# EAGLE design power-switch (EAGLE 9.5.1)
CNAME: PepeTech; CREVISION: 2.0; DESIGNER: Joao Silva

## Sheet 1 of 4: Power
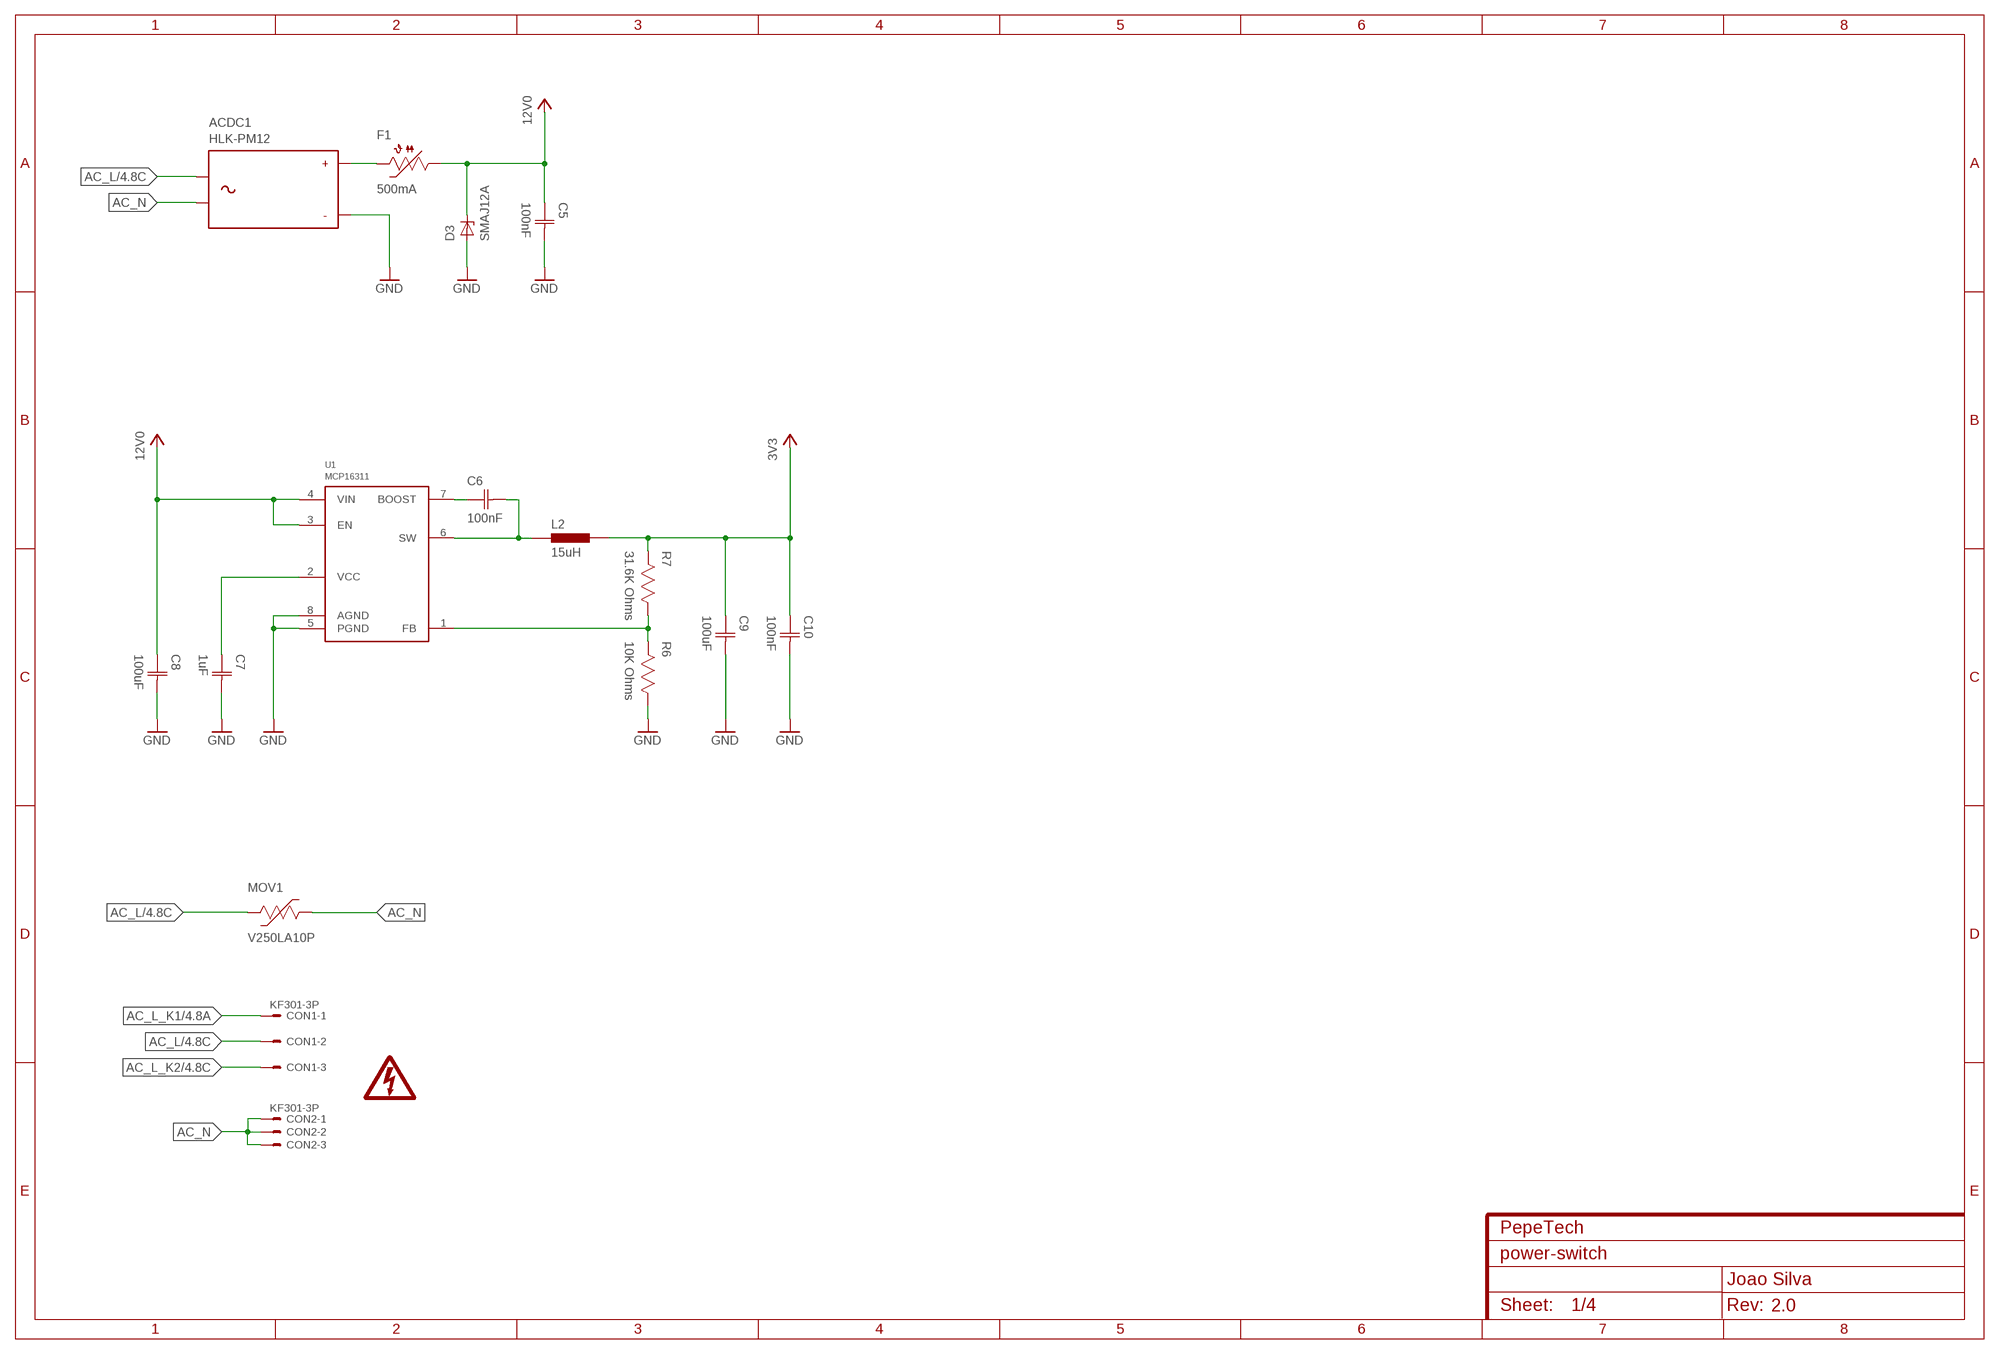
[diagram p0: schematic, sheet 1]

### Parts
ACDC1  HLK-PM12  [HLK-PM12]
C5  100nF  CAPACITOR-0603  [CAP0603]
C6  100nF  CAPACITOR-0603  [CAP0603]
C7  1uF  CAPACITOR-0603  [CAP0603]
C8  100uF  CAPACITOR-1206  [CAP1206]
C9  100uF  CAPACITOR-1206  [CAP1206]
C10  100nF  CAPACITOR-0603  [CAP0603]
CON1  KF301-3P  [KF301-3P]
CON2  KF301-3P  [KF301-3P]
D3  SMAJ12A  [DO214AC]
F1  500mA Hold  PTC1812  [1812]
L2  15uH  INDUCTOR-2.5X2X1.2MM  [IND2520]
LOGO1  HV_WARNING  [HV_WARNING]
MOV1  V250LA10P  [VXXXLA10P]
R6  10K Ohms  RESISTOR-0603  [RES0603]
R7  31.6K Ohms  RESISTOR-0603  [RES0603]
U1  MCP16311  [MSOP8]

### Nets
3V3: C9.1(C1) C10.1(C1) L2.2 R7.2 ; also sheet 2,3,4
12V0: C5.1(C1) C8.1(C1) D3.C F1.1 U1.3(EN) U1.4(VIN) ; also sheet 4
AC_L: ACDC1.AC1 CON1.2 MOV1.2 ; also sheet 4
AC_L_K1: CON1.1 ; also sheet 4
AC_L_K2: CON1.3 ; also sheet 4
AC_N: ACDC1.AC2 CON2.1 CON2.2 CON2.3 MOV1.1
GND: ACDC1.-VO C5.2(C2) C7.2(C2) C8.2(C2) C9.2(C2) C10.2(C2) D3.A R6.1 U1.5(PGND) U1.8(AGND) ; also sheet 2,3,4
N$6: C6.2(C2) L2.1 U1.6(SW)
N$7: ACDC1.+VO F1.2
N$8: C6.1(C1) U1.7(BOOST)
N$9: C7.1(C1) U1.2(VCC)
N$10: R6.2 R7.1 U1.1(FB)

## Sheet 2 of 4: Main MCU
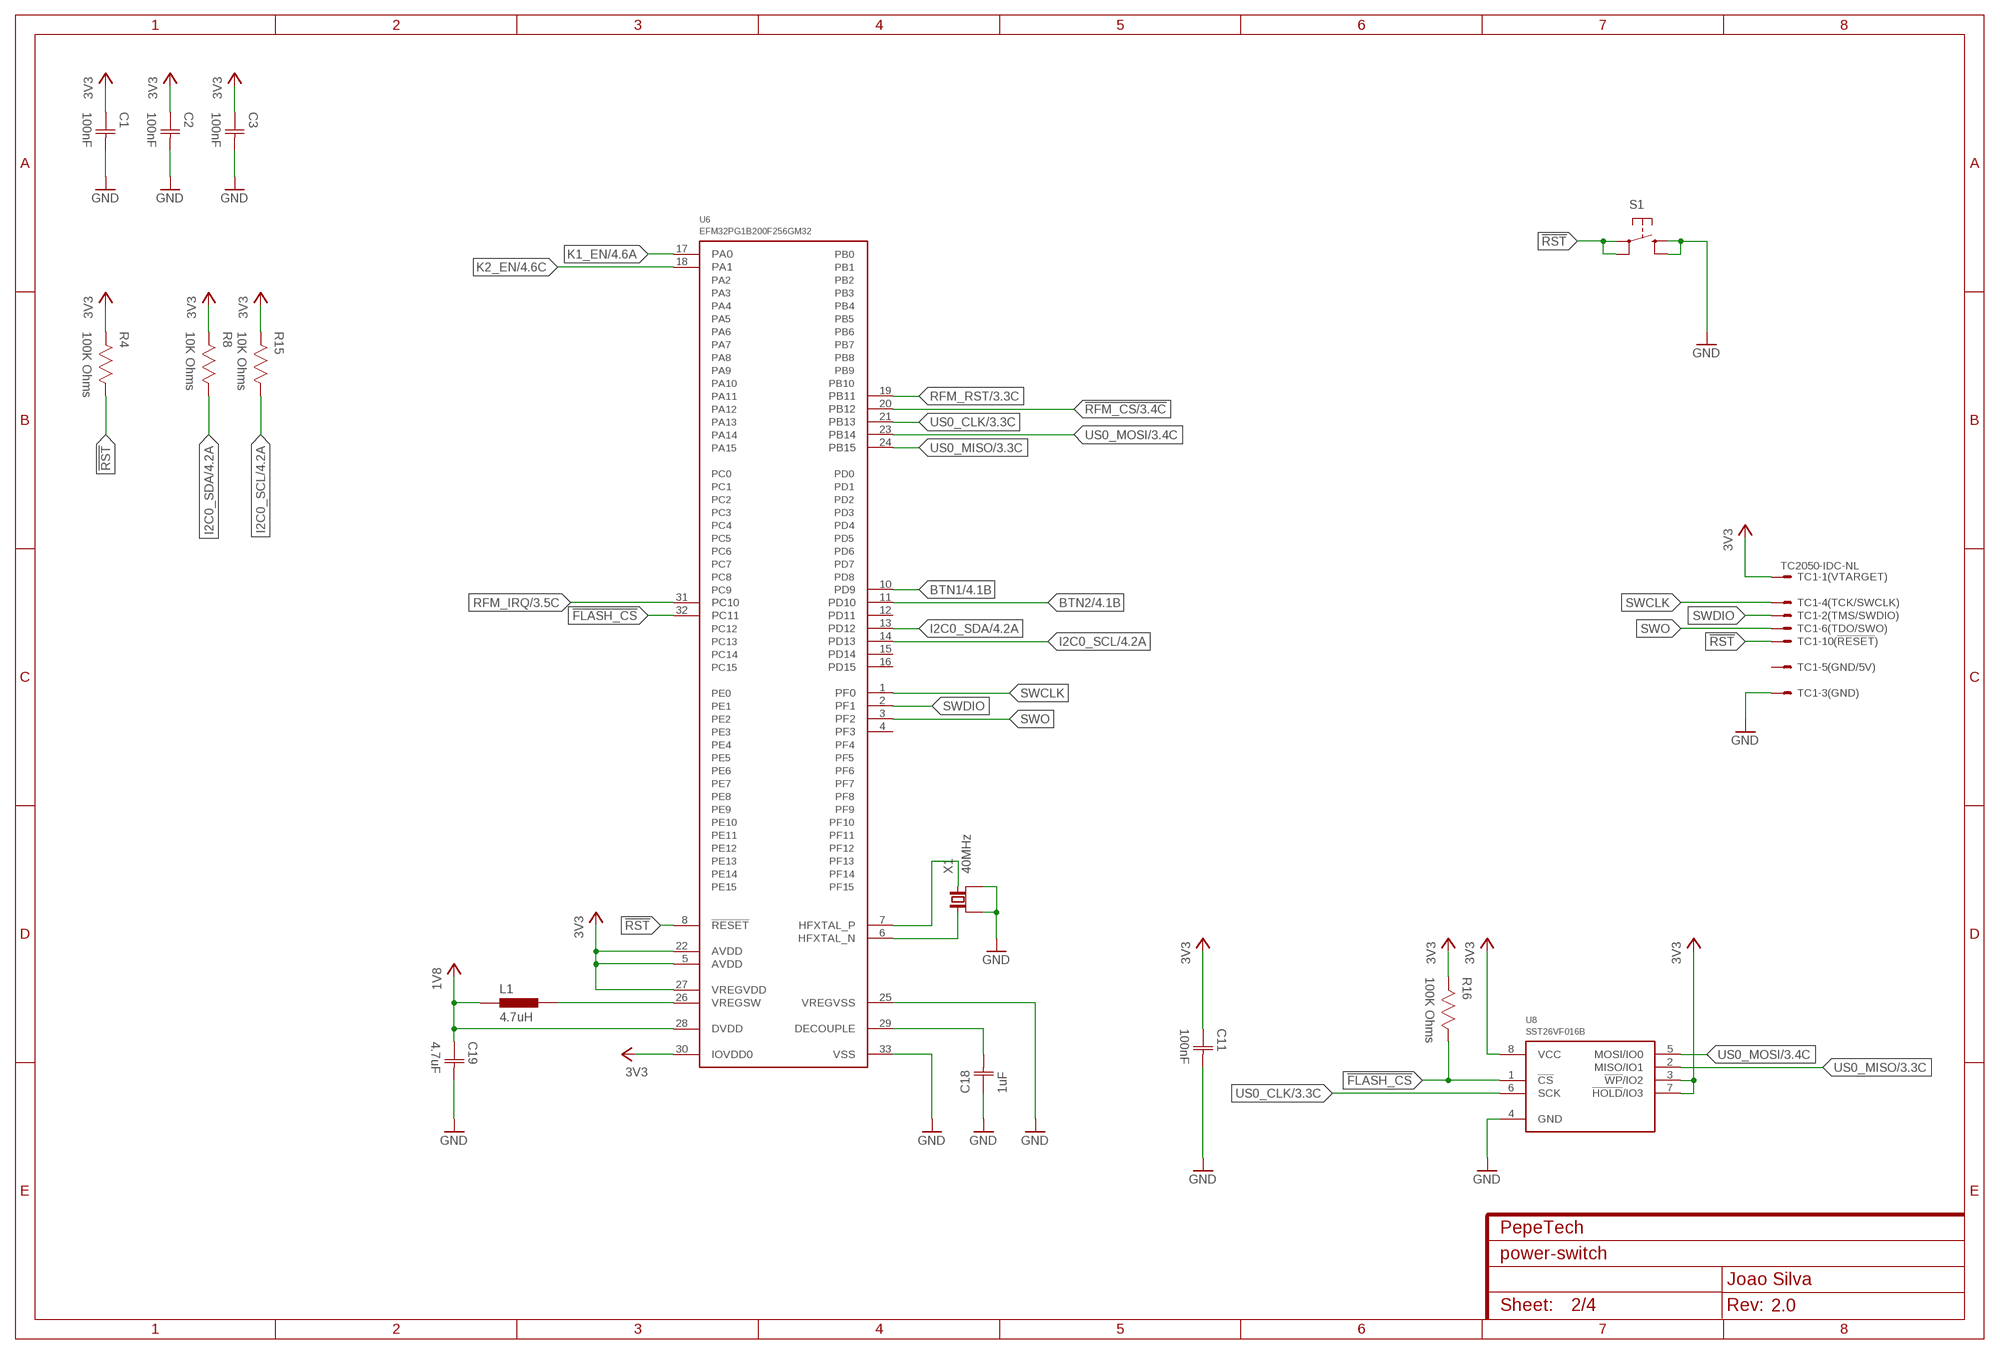
[diagram p1: schematic, sheet 2]

### Parts
C1  100nF  CAPACITOR-0603  [CAP0603]
C2  100nF  CAPACITOR-0603  [CAP0603]
C3  100nF  CAPACITOR-0603  [CAP0603]
C11  100nF  CAPACITOR-0603  [CAP0603]
C18  1uF  CAPACITOR-0603  [CAP0603]
C19  4.7uF  CAPACITOR-0603  [CAP0603]
L1  4.7uH  INDUCTOR-0603  [IND0603]
R4  100K Ohms  RESISTOR-0603  [RES0603]
R8  10K Ohms  RESISTOR-0603  [RES0603]
R15  10K Ohms  RESISTOR-0603  [RES0603]
R16  100K Ohms  RESISTOR-0603  [RES0603]
S1  TAC_SWITCHSMD  [TAC_SW_SMD_RESET]
TC1  TC2050-IDC-NL  [TC2050-IDC-NL]
U6  EFM32PG1B200F256GM32  [QFN32_0.5P]
U8  SST26VF016B  [WSOIC8]
X1  40MHz  CRYSTAL_4P  [4-SMD-3225]

### Nets
1V8: C19.1(C1) L1.1 U6.28(DVDD)
3V3: C1.1(C1) C2.1(C1) C3.1(C1) C11.1(C1) R4.2 R8.2 R15.2 R16.2 TC1.1 U6.5(AVDD) U6.22(AVDD) U6.27(VREGVDD) U6.30(IOVDD0) U8.3(!WP!/IO2) U8.7(!HOLD!/IO3) U8.8(VCC) ; also sheet 1,3,4
!FLASH_CS: R16.1 U6.32(PC11) U8.1(!CS!)
!RFM_CS: U6.20(PB12) ; also sheet 3
!RST: R4.1 S1.1 S1.2 TC1.10 U6.8(!RESET)
BTN1: U6.10(PD9) ; also sheet 4
BTN2: U6.11(PD10) ; also sheet 4
GND: C1.2(C2) C2.2(C2) C3.2(C2) C11.2(C2) C18.1(C1) C19.2(C2) S1.3 S1.4 TC1.3 U6.25(VREGVSS) U6.33(VSS) U8.4(GND) X1.1(GND) X1.3(GND) ; also sheet 1,3,4
I2C0_SCL: R15.1 U6.14(PD13) ; also sheet 4
I2C0_SDA: R8.1 U6.13(PD12) ; also sheet 4
K1_EN: U6.17(PA0) ; also sheet 4
K2_EN: U6.18(PA1) ; also sheet 4
N$16: U6.6(HFXTAL_N) X1.2
N$17: U6.7(HFXTAL_P) X1.4
N$19: L1.2 U6.26(VREGSW)
N$20: C18.2(C2) U6.29(DECOUPLE)
RFM_IRQ: U6.31(PC10) ; also sheet 3
RFM_RST: U6.19(PB11) ; also sheet 3
SWCLK: TC1.4 U6.1(PF0)
SWDIO: TC1.2 U6.2(PF1)
SWO: TC1.6 U6.3(PF2)
US0_CLK: U6.21(PB13) U8.6(SCK) ; also sheet 3
US0_MISO: U6.24(PB15) U8.2(MISO/IO1) ; also sheet 3
US0_MOSI: U6.23(PB14) U8.5(MOSI/IO0) ; also sheet 3
Unconnected: TC1.5 TC1.7 TC1.8 TC1.9 U6.4(PF3) U6.12(PD11) U6.15(PD14) U6.16(PD15)

## Sheet 3 of 4: ISM Radio
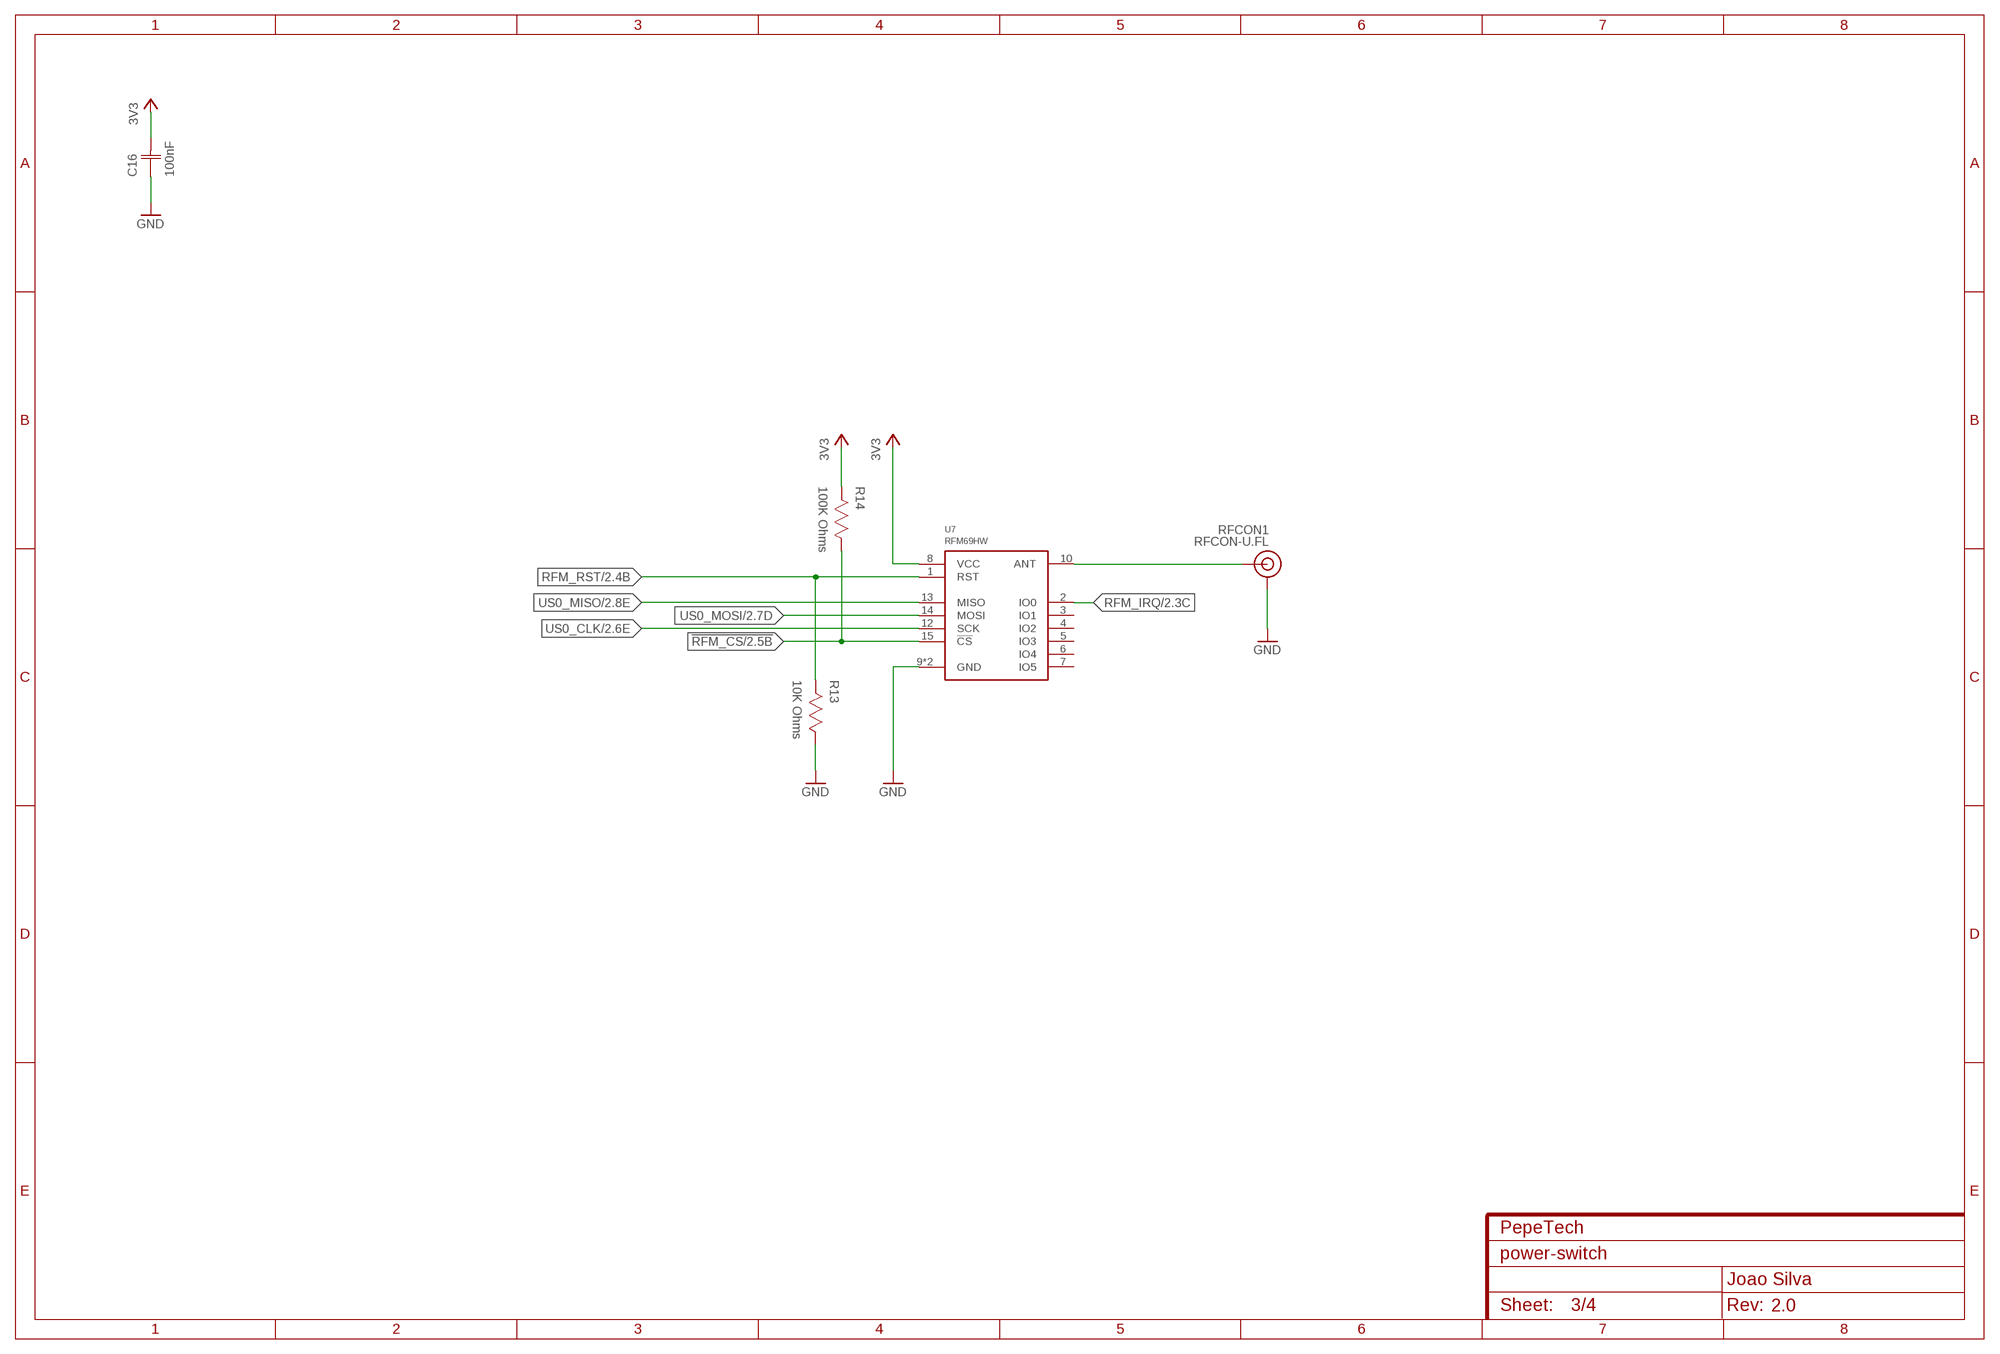
[diagram p2: schematic, sheet 3]

### Parts
C16  100nF  CAPACITOR-0603  [CAP0603]
R13  10K Ohms  RESISTOR-0603  [RES0603]
R14  100K Ohms  RESISTOR-0603  [RES0603]
RFCON1  RFCON-U.FL  [U.FL]
U7  RFM69HW  [RFM69XW-XXXS2]

### Nets
3V3: C16.2(C2) R14.2 U7.8(VCC) ; also sheet 1,2,4
!RFM_CS: R14.1 U7.15(!CS) ; also sheet 2
GND: C16.1(C1) R13.1 RFCON1.P$1(GND) RFCON1.P$2(GND) U7.9(GND) U7.11(GND) ; also sheet 1,2,4
N$1: RFCON1.P$3(SIGNAL) U7.10(ANT)
RFM_IRQ: U7.2(IO0) ; also sheet 2
RFM_RST: R13.2 U7.1(RST) ; also sheet 2
US0_CLK: U7.12(SCK) ; also sheet 2
US0_MISO: U7.13(MISO) ; also sheet 2
US0_MOSI: U7.14(MOSI) ; also sheet 2
Unconnected: U7.3(IO1) U7.4(IO2) U7.5(IO3) U7.6(IO4) U7.7(IO5)

## Sheet 4 of 4: Sensors/Interface
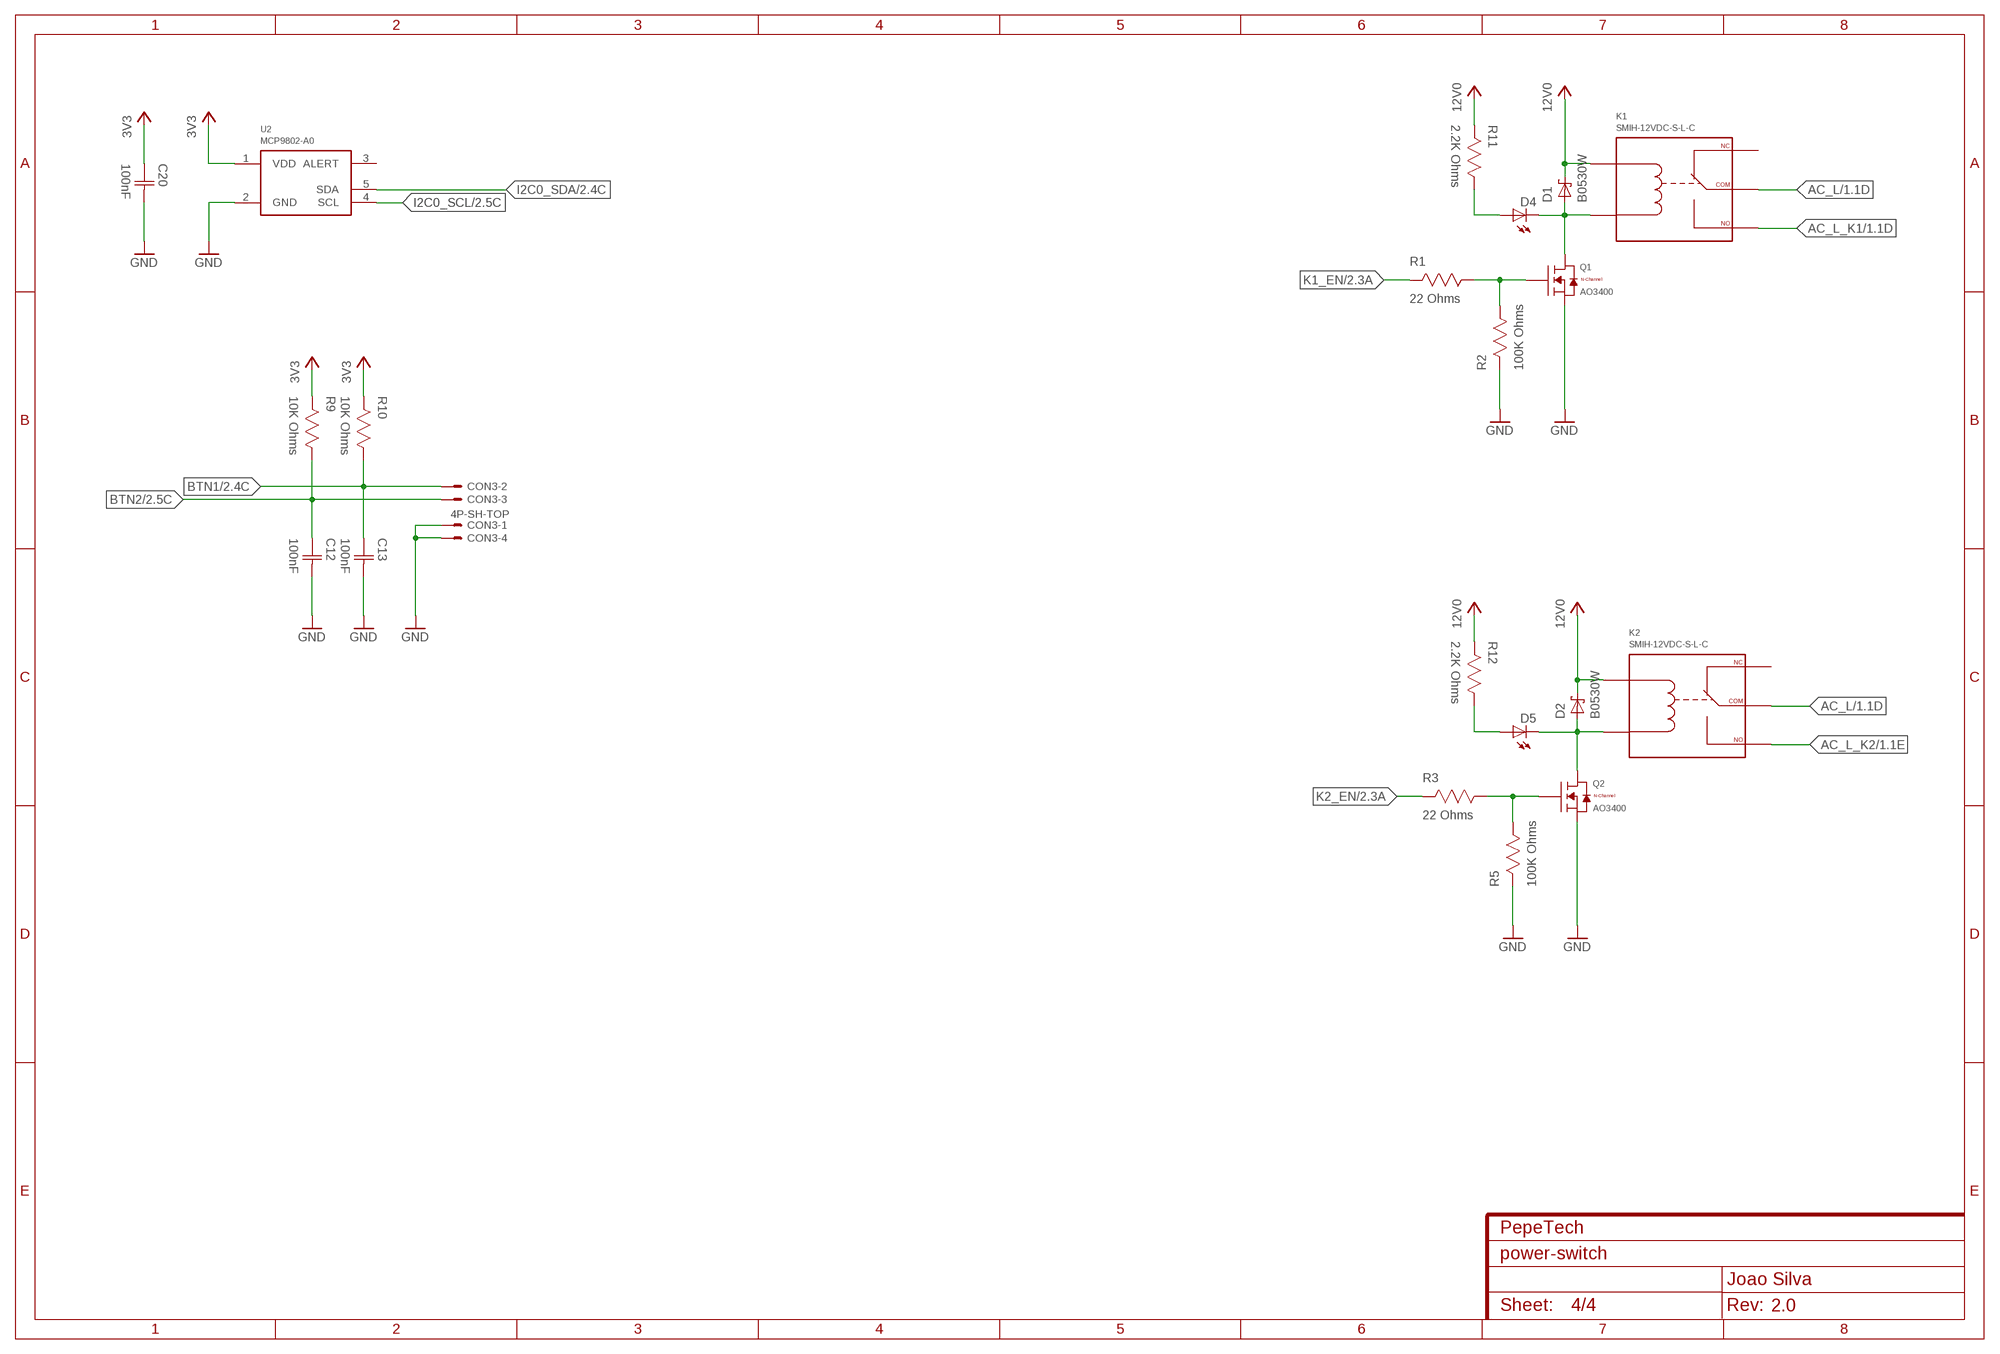
[diagram p3: schematic, sheet 4]

### Parts
C12  100nF  CAPACITOR-0603  [CAP0603]
C13  100nF  CAPACITOR-0603  [CAP0603]
C20  100nF  CAPACITOR-0603  [CAP0603]
CON3  4P-SH-TOP  [SH-04-TOP]
D1  B0530W  [SOD-123]
D2  B0530W  [SOD-123]
D4  LED1206  [1206]
D5  LED1206  [1206]
K1  SMIH-12VDC-S-L-C  [SMIH-12VDC-S-L-C]
K2  SMIH-12VDC-S-L-C  [SMIH-12VDC-S-L-C]
Q1  AO3400  [SOT23]
Q2  AO3400  [SOT23]
R1  22 Ohms  RESISTOR-0603  [RES0603]
R2  100K Ohms  RESISTOR-0603  [RES0603]
R3  22 Ohms  RESISTOR-0603  [RES0603]
R5  100K Ohms  RESISTOR-0603  [RES0603]
R9  10K Ohms  RESISTOR-0603  [RES0603]
R10  10K Ohms  RESISTOR-0603  [RES0603]
R11  2.2K Ohms  RESISTOR-0603  [RES0603]
R12  2.2K Ohms  RESISTOR-0603  [RES0603]
U2  MCP9802-A0  [SOT23-5]

### Nets
3V3: C20.1(C1) R9.2 R10.2 U2.1(VDD) ; also sheet 1,2,3
12V0: D1.C D2.C K1.COIL1 K2.COIL1 R11.2 R12.2 ; also sheet 1
AC_L: K1.COM1(COM) K1.COM2(COM) K2.COM1(COM) K2.COM2(COM) ; also sheet 1
AC_L_K1: K1.NO1(NO) K1.NO2(NO) ; also sheet 1
AC_L_K2: K2.NO1(NO) K2.NO2(NO) ; also sheet 1
BTN1: C13.1(C1) CON3.2 R10.1 ; also sheet 2
BTN2: C12.1(C1) CON3.3 R9.1 ; also sheet 2
GND: C12.2(C2) C13.2(C2) C20.2(C2) CON3.1 CON3.4 Q1.2(S) Q2.2(S) R2.2 R5.2 U2.2(GND) ; also sheet 1,2,3
I2C0_SCL: U2.4(SCL) ; also sheet 2
I2C0_SDA: U2.5(SDA) ; also sheet 2
K1_EN: R1.2 ; also sheet 2
K2_EN: R3.2 ; also sheet 2
N$2: Q1.1(G) R1.1 R2.1
N$3: D1.A D4.C K1.COIL2 Q1.3(D)
N$4: Q2.1(G) R3.1 R5.1
N$5: D2.A D5.C K2.COIL2 Q2.3(D)
N$11: D4.A R11.1
N$12: D5.A R12.1
Unconnected: K1.NC1(NC) K1.NC2(NC) K2.NC1(NC) K2.NC2(NC) U2.3(ALERT)

## Library data of the parts
ACDC1 = ACDC Converter:HLK-PM
C1-C3 C5-C13 C16 C18-C20 = Capacitor:CAPACITOR
CON1 CON2 = Generic Connector:KF301-3P
CON3 = JST:4P: Disconnectable Crimp style connector, 1.0mm pitch 4 contacts
D1 D2 = Generic Diode:B0530W
D3 = TVS:SMAJ*A: SMAJ Series TVS Diodes Source: http://www.littelfuse.com/~/media/electronics/datasheets/tvs_diodes/littelfuse_tvs_diode_smaj_datasheet.pdf.pdf; MF: Littelfuse; MPN: SMAJ12A; OC_FARNELL: 1827602; OC_NEWARK: 71J1937
D4 D5 = LED:LED
F1 = PTC Fuses:PTC; HOLD: 500mA
K1 K2 = Relay:SMIH-12VDC-S-L-C
L1 = Inductor:INDUCTOR; OCLCSC: C281111
L2 = Inductor:INDUCTOR; OCLCSC: C365885
LOGO1 = Silkscreen:HV_WARNING
MOV1 = Varistor:V250LA10P
Q1 Q2 = Alpha Omega:AO3400
R1-R16 = Resistor:RESISTOR
RFCON1 = RF Connector:RFCON
S1 = Switch:TAC_SWITCH: Momentary Switch Button commonly used for reset or general input. Spark Fun Electronics SKU : COM-00097
TC1 = TagConnect:TC2050-IDC
U1 = Microchip:MCP1631*
U2 = Microchip:MCP9802-A*
U6 = EFM32:EFM32PG1B200F*M32
U7 = HopeRF:RFM69*
U8 = Microchip:SST26VF016B
X1 = Crystal:CRYSTAL_4P

## Board
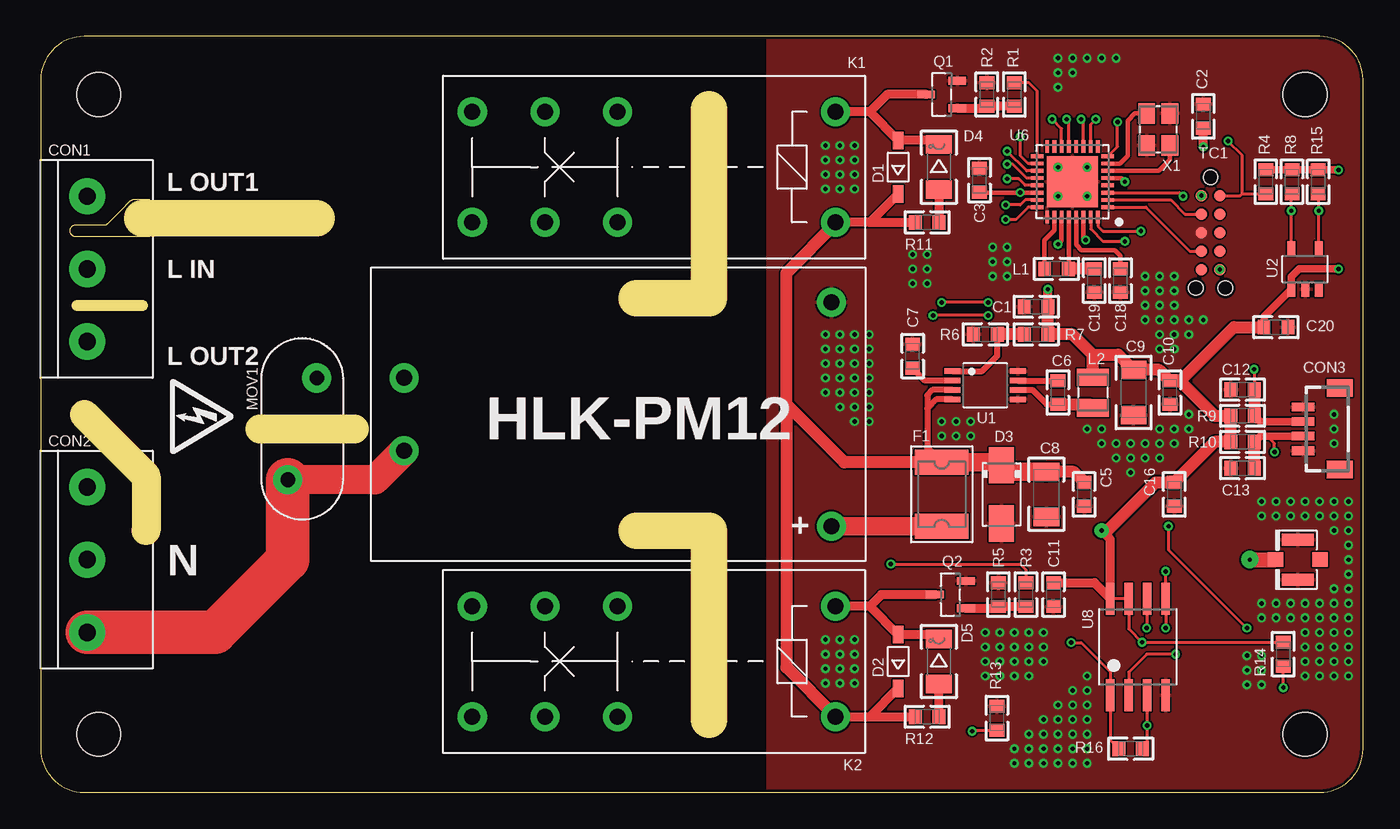
[diagram p4: board, top side]
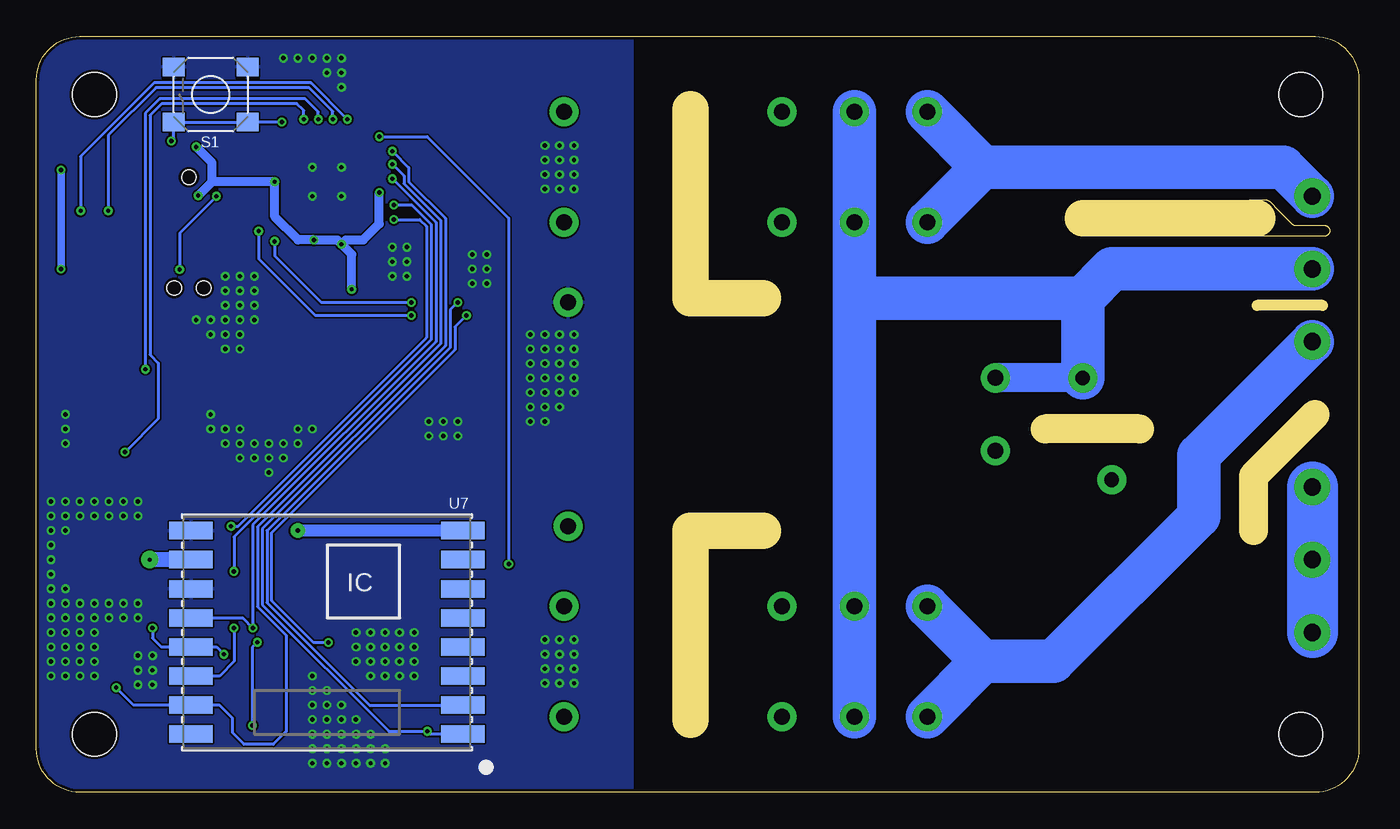
[diagram p5: board, bottom side, seen from below]

Size 91 x 52 mm. Coordinates in mm from the lower left corner, seen from the top.
Outline: 0,49 0,3 arc90 3,0 88,0 arc90 91,3 91,49 arc90 88,52 3,52 arc90 0,49
Copper layers (1*16): Top 0.035mm / dielectric 1.6mm / Bottom 0.035mm
Design rules "jlcpcb_2layer": minimum track width 5mil, minimum drill 0.3mm, track to track 5mil, track to pad 5mil, pad to pad 5mil, via to via 5mil, smd to smd 5mil, copper to edge 0.2mm, drill to drill 5mil, minimum pad ring 3mil, minimum via ring 3mil, stop-mask expansion 0.075mm, vias tented up to drill 10mm, thermal gap 5mil
Holes 3 mm at 4,48 87,48 87,4 4,4
Milling: area 2,38.2 to 7.5,40.8; 9 lines

### Footprints (pad centres in the part's own frame; a part is rotated, then mirrored left to right if it is on the bottom)
HLK-PM12 = drill 1.1 pad 2: +VO 29.4,-7.7; -VO 29.4,7.7; AC1 0,2.5; AC2 0,-2.5
CAP0603 = smd 0.889 x 1.016: 1 -0.819,0; 2 0.819,0
CAP1206 = smd 1.27 x 1.778: 1 -1.549,0; 2 1.549,0
KF301-3P = drill 1.2 pad 2.5: 1 -5,0; 2 0,0; 3 5,0
SH-04-TOP = smd 0.6 x 1.55: 1 1.5,-1.625; 2 0.5,-1.625; 3 -0.5,-1.625; 4 -1.5,-1.625 | smd 1.2 x 1.8: FIT@1 2.8,0.9; FIT@2 -2.8,0.9
SOD-123 = smd 1.2 x 0.7: A 1.85,0; C -1.85,0
DO214AC = smd 2.5 x 1.7: A 2,0; C -2,0
1206 = smd 1.27 x 1.778: A 1.549,0; C -1.549,0
1812 = smd 1.7 x 3.7: 1 -2.2,0; 2 2.2,0
SMIH-12VDC-S-L-C = drill 1.1 pad 2: COIL1 -15,3.8; COIL2 -15,-3.8; COM1 5,3.8; COM2 5,-3.8; NC1 0,3.8; NC2 0,-3.8; NO1 10,3.8; NO2 10,-3.8
IND0603 = smd 0.889 x 1.016: 1 -0.819,0; 2 0.819,0
IND2520 = smd 2.2 x 1.2: 1 0,-1.05; 2 0,1.05
VXXXLA10P = drill 1 pad 2: 1 -3.5,1; 2 3.5,-1
SOT23 = smd 1.219 x 0.533: 1 -1.067,0.94; 2 -1.067,-0.94; 3 1.067,0
RES0603 = smd 0.889 x 1.016: 1 -0.819,0; 2 0.819,0
U.FL = smd 2.2 x 0.85: P$1 0,1.375; P$2 0,-1.375 | smd 1.05 x 1: P$3 1.525,0; P$4 -1.525,0
TAC_SW_SMD_RESET = smd 1.524 x 1.27: 1 -2.54,1.905; 2 2.54,1.905; 3 -2.54,-1.905; 4 2.54,-1.905
TC2050-IDC-NL = smd 0.787 x 0.787: 1 -2.54,-0.635; 2 -1.27,-0.635; 3 0,-0.635; 4 1.27,-0.635; 5 2.54,-0.635; 6 2.54,0.635; 7 1.27,0.635; 8 0,0.635; 9 -1.27,0.635; 10 -2.54,0.635 | hole 0.991: -3.81,0; 3.81,1.016; 3.81,-1.016
MSOP8 = smd 0.4 x 1.1: 1 -0.975,-2.25; 2 -0.325,-2.25; 3 0.325,-2.25; 4 0.975,-2.25; 5 0.975,2.25; 6 0.325,2.25; 7 -0.325,2.25; 8 -0.975,2.25
SOT23-5 = smd 1 x 0.55: 1 -1.4,0.95; 2 -1.4,0; 3 -1.4,-0.95; 4 1.4,-0.95; 5 1.4,0.95
QFN32_0.5P = smd 0.86 x 0.26: 1 -2.43,1.75; 2 -2.43,1.25; 3 -2.43,0.75; 4 -2.43,0.25; 5 -2.43,-0.25; 6 -2.43,-0.75; 7 -2.43,-1.25; 8 -2.43,-1.75; 17 2.43,-1.75; 18 2.43,-1.25; 19 2.43,-0.75; 20 2.43,-0.25; 21 2.43,0.25; 22 2.43,0.75; 23 2.43,1.25; 24 2.43,1.75 | smd 0.26 x 0.86: 9 -1.75,-2.43; 10 -1.25,-2.43; 11 -0.75,-2.43; 12 -0.25,-2.43; 13 0.25,-2.43; 14 0.75,-2.43; 15 1.25,-2.43; 16 1.75,-2.43; 25 1.75,2.43; 26 1.25,2.43; 27 0.75,2.43; 28 0.25,2.43; 29 -0.25,2.43; 30 -0.75,2.43; 31 -1.25,2.43; 32 -1.75,2.43 | smd 3.5 x 3.5: 33 0,0
RFM69XW-XXXS2 = smd 3 x 1.2: 1 -9.35,7; 2 -9.35,5; 3 -9.35,3; 4 -9.35,1; 5 -9.35,-1; 6 -9.35,-3; 7 -9.35,-5; 8 -9.35,-7; 9 9.35,-7; 10 9.35,-5; 11 9.35,-3; 12 9.35,-1; 13 9.35,1; 14 9.35,3; 15 9.35,5; 16 9.35,7
WSOIC8 = smd 0.6 x 2.2: 1 -1.905,-3.33; 2 -0.635,-3.33; 3 0.635,-3.33; 4 1.905,-3.33; 5 1.905,3.33; 6 0.635,3.33; 7 -0.635,3.33; 8 -1.905,3.33
4-SMD-3225 = smd 1.4 x 1.15: 1 -1.1,0.8; 2 1.1,0.8; 3 1.1,-0.8; 4 -1.1,-0.8

### Placement (x,y rotation side)
ACDC1  25,26 0 top
C1  68.5,33.4 180 top
C2  80,46.5 90 top
C3  64.6,42.1 90 top
C5  71.8,20.5 270 top
C6  70,27.5 270 top
C7  60,30 90 top
C8  69.2,20.5 270 top
C9  75.2,27.5 270 top
C10  77.7,27.5 270 top
C11  69.7,13.6 270 top
C12  82.7,27.7 180 top
C13  82.7,22.3 180 top
C16  78,20.5 90 top
C18  74.3,35.2 90 top
C19  72.5,35.2 270 top
C20  85,32 0 top
CON1  3.2,36 270 top
CON2  3.2,16 270 top
CON3  88.5,25 270 top
D1  59,43 90 top
D2  59,9 90 top
D3  66.1,20.5 270 top
D4  61.8,43 270 top
D5  61.8,9 270 top
F1  62,20.5 270 top
K1  39.7,43 180 top
K2  39.7,9 180 top
L1  69.9,36 180 top
L2  72.4,27.5 0 top
LOGO1  8.9,28.4 270 top
MOV1  18,25 90 top
Q1  62,48 180 top
Q2  62.6,13.6 180 top
R1  67,48 90 top
R2  65.1,48 90 top
R3  67.8,13.6 90 top
R4  84.3,42 90 top
R5  65.9,13.6 90 top
R6  65,31.5 0 top
R7  68.5,31.5 0 top
R8  86.1,42 90 top
R9  82.7,25.9 180 top
R10  82.7,24.1 180 top
R11  61,39.2 180 top
R12  61,5.2 180 top
R13  65.8,5.1 270 top
R14  85.5,9.5 90 top
R15  87.9,42 90 top
R16  75,3 0 top
RFCON1  86.5,16 180 top
S1  79,48 180 bottom
TC1  80.5,38.5 270 top
U1  65,28 270 top
U2  87,36 90 top
U6  71,42 180 top
U7  71,11 180 bottom
U8  75.5,10 0 top
X1  76.9,45.6 270 top

### Tracks (layer width: path | path; a pad name or v marks a point on that pad's centre or on a via)
1V8
  Top 0.305: U6.28 70.75,36.03 70.74,36.02
  Top 0.813: C19.1 70.74,36.02 L1.1
3V3  (via drill 0.3, 0.3 pad 1)
  Top 0.2: U8.8 U8.7 74.86,11.23 v75.78,10.32 R14.2 | R16.2 76.14,3.32 v76.14,4.6 U8.3
  Top 0.305: U6.22 v67.4,41.25 64.63,41.25 C3.1 | v70,37.7 70.25,37.95 U6.27 | v71.9,38 71.75,38.15 U6.30 | v74.6,42 74.35,42.25 U6.5
  Top 0.508: C20.1 84.18,32.73 U2.1 86.05,35.45 86.6,36 v89.3,36 | v89.3,42.8 89.28,42.82 R15.2 R8.2 R4.2
  Top 0.61: C1.1 69.32,34.58 v69.3,34.6 | v73,18 73.59,17.41 U8.8 72.51,14.42 C11.1 | v80,44.4 C2.1
  Top 0.813: C10.1 76.97,29.05 C9.1 74.15,30.1 72.4,30.1 | L2.2 72.4,30.1 | 72.4,30.1 71,31.5 R7.2 C1.1 | C10.1 78.38,28.32 80.8,25.9 R9.2 R10.2 80.78,24.1 C16.2 76.72,21.32 73.4,18 v73,18 | C10.1 78.42,28.32 82.1,32 C20.1
  Bottom 0.2: v75.78,10.32 76.14,9.96 v76.14,4.6
  Bottom 0.508: v89.3,36 v89.3,42.8
  Bottom 0.61: v69.3,34.6 69.3,37 v70,37.7 | v70,37.7 70.3,38 v71.9,38 73,38 74.6,39.6 v74.6,42 78.91,42 | v70,37.7 69.7,38 68.5,38 67.4,39.1 v67.4,41.25 | 78.91,42 TC1.1 | 78.91,42 78.91,43.3 v80,44.4
  Bottom 0.813: U7.8 v73,18
  other vias: 79.86,41.04
12V0
  Top 0.406: U1.4 61.62,27.02 61,26.4 | 61,26.4 61,23.7 F1.1 | U1.3 61.38,27.68 61,27.3 61,26.4
  Top 0.61: D1.C 57.05,39.2 | 57.05,39.2 54.8,39.2 K1.COIL1 | K2.COIL1 57.05,5.2 | 57.05,5.2 D2.C | 57.05,39.2 R11.2 | 57.05,5.2 R12.2
  Top 0.813: C5.1 71.07,22.05 C8.1 | F1.1 55.3,22.7 51.3,26.7 | 51.3,26.7 51.3,35.7 54.8,39.2 | 51.3,26.7 51.3,8.6 K2.COIL1
  Top 1.27: F1.1 65.9,22.7 D3.C 66.55,22.05 C8.1
!FLASH_CS  (via drill 0.3)
  Top 0.2: R16.1 73.59,3.59 U8.1 73.59,8.3 71.6,10.3 v70.9,10.3 | U6.32 72.75,38.95 73.1,38.6 v75.7,38.6 | v65.2,32.8 v61.4,32.8
  Bottom 0.2: v75.7,38.6 75.7,36.7 71.8,32.8 v65.2,32.8 | v61.4,32.8 62.19,32.01 62.19,30.46 74.79,17.86 74.79,13.18 71.91,10.3 v70.9,10.3
!RFM_CS  (via drill 0.3)
  Top 0.2: v85.5,7.2 R14.1 | U6.20 67.85,42.25 66.9,43.2 v66.5,43.2
  Bottom 0.2: v85.5,7.2 84.3,6 U7.15 78.4,6 77.5,5.1 77.5,4.1 76.7,3.3 74.7,3.3 73.8,4.2 73.8,10.8 75.77,12.77 75.77,18.27 63.17,30.86 63.17,39.34 65.7,41.86 65.7,42.4 v66.5,43.2
!RST  (via drill 0.3)
  Top 0.2: TC1.10 82.54,41.04 82.68,41.18 | 82.68,41.18 R4.1 | 82.68,41.18 82.68,43.82 v81.7,44.8 | U6.8 74.1,44.42 v74.1,46.1
  Bottom 0.2: v81.7,44.8 81.54,44.96 S1.2 76.6,46.09 | 76.6,46.09 S1.1 | v74.1,46.1 76.59,46.1 76.6,46.09
AC_L
  Bottom 2: MOV1.2 ACDC1.AC1
  Bottom 3: CON1.2 17,36 19,34 | 19,34 34.7,34 | 34.7,34 K1.COM1 | K1.COM1 K1.COM2 | K2.COM1 K2.COM2 34.7,34 | K1.COM1 34.7,39.3 | 19,34 MOV1.2
AC_L_K1
  Bottom 3: CON1.1 5.2,43 25.9,43 | 25.9,43 K1.NO2 | K1.NO1 25.9,43
AC_L_K2
  Bottom 3: 25.9,9 21,9 11,19 11,23.2 CON1.3 | 25.9,9 K2.NO2 | K2.NO1 25.9,9
AC_N
  Top 2: ACDC1.AC2 23,21.5 MOV1.1
  Top 3: CON2.3 12,11 17,16 MOV1.1
  Bottom 3.5: CON2.1 CON2.2 CON2.3
BTN1  (via drill 0.3)
  Top 0.2: U6.10 72.25,45.95 v72.6,46.3 | v84.9,23.4 84.9,24 84.4,24.5
  Top 0.508: CON3.2 84.4,24.5 83.92,24.5 R10.1
  Top 0.813: C13.1 R10.1
  Bottom 0.2: v72.6,46.3 72.6,46.9 73.07,47.37 82.36,47.37 83.17,46.56 83.17,30.1 82.6,29.53 82.6,25.7 v84.9,23.4
BTN2  (via drill 0.3)
  Top 0.2: U6.11 71.75,46.15 v71.6,46.3 | v83.5,29.1 83.5,27.72 C12.1
  Top 0.508: CON3.3 83.92,25.5 R9.1
  Top 0.813: C12.1 R9.1
  Bottom 0.2: v71.6,46.3 71.6,46.8 72.5,47.7 82.5,47.7 83.5,46.7 v83.5,29.1
GND  (via drill 0.3)
  Top 0.2: U6.33 v70,41 | U6.33 v72,41 | U6.33 v72,43 | U6.33 v70,43
  other vias: 72,25 73,25 73,24 74,24 75,24 76,24 77,24 77,23 76,23 75,23 74,23 75,22 79,25 78,25 77,25 78,24 79,26 86,19 85,19 84,19 86,20 85,20 84,20 89,20 88,20 87,20 90,20 90,19 90,18 89,19 88,19 87,19 89,18 90,17 90,16 90,15 89,14 90,14 90,13 90,12 89,13 88,13 87,13 86,13 85,13 84,13 86,12 85,12 84,12 89,12 88,12 87,12 90,9 90,8 89,9 88,9 87,9 89,8 88,8 87,8 90,11 90,10 89,11 88,11 87,11 89,10 88,10 87,10 83,9.4 83,8.4 83,7.4 84,9.4 84,8.4 84,7.4 72,6 70,6 72,5 71,5 70,5 72,4 71,4 70,4 69,4 69,3 68,3 67,3 69,2 68,2 67,2 68,4 69,5 71,6 71,7 72,7 72,3 71,3 70,3 72,2 71,2 70,2 72,8 68,9 68,8 67,8 66,8 67,9 68,10 65,10 67,10 65,11 66,11 67,11 68,11 66,10 66,9 65,9 65,8 69,9 69,10 69,11 56,7.5 55,7.5 56,8.5 54,9.5 56,9.5 54,10.5 55,10.5 56,10.5 55,9.5 55,8.5 54,8.5 54,7.5 56,41.5 55,41.5 56,42.5 54,43.5 56,43.5 54,44.5 55,44.5 56,44.5 55,43.5 55,42.5 54,42.5 54,41.5 56,25.5 56,26.5 54,27.5 56,27.5 55,27.5 55,26.5 56,28.5 55,28.5 56,29.5 54,30.5 56,30.5 54,31.5 55,31.5 56,31.5 55,30.5 55,29.5 54,29.5 54,28.5 57,25.5 57,26.5 57,27.5 57,28.5 57,29.5 57,30.5 57,31.5 63,24.5 63,25.5 62,25.5 62,24.5 64,24.5 64,25.5 61,36 60,36 60,35 61,35 61,37 60,37 66.5,36.5 65.5,36.5 65.5,35.5 66.5,35.5 66.5,37.5 65.5,37.5 80,32.5 77,32.5 77,33.5 76,33.5 76,32.5 78,32.5 78,33.5 77,31.5 78,31.5 77,34.5 77,35.5 76,35.5 76,34.5 78,34.5 78,35.5 77,30.5 78,30.5 79,31.5 79,32.5 74,50.5 71,50.5 70,50.5 72,50.5 73,50.5 71,49.5 70,49.5 70,48.5 89,26 89,25 89,24
  pour Top: 50,55 50,-3 94.5,-3 94.5,55
  pour Bottom: 50,56.5 50,-4 96,-4 96,56.5
I2C0_SCL  (via drill 0.3)
  Top 0.2: U2.4 v87.95,40 87.95,41.13 R15.1 | U6.14 70.25,45.65 v69.6,46.3
  Bottom 0.2: v69.6,46.3 72.1,48.8 82.9,48.8 87.95,43.75 v87.95,40
I2C0_SDA  (via drill 0.3)
  Top 0.2: U2.5 v86.05,40 86.05,41.13 R8.1 | U6.13 70.75,46.15 v70.6,46.3
  Bottom 0.2: v70.6,46.3 70.6,46.84 72.23,48.47 82.77,48.47 86.05,45.19 v86.05,40
K1_EN
  Top 0.2: U6.17 68.57,48.23 67.98,48.82 R1.2
K2_EN  (via drill 0.3)
  Top 0.2: U6.18 67.95,43.25 67.4,43.8 v67.4,45.1 | v58.5,15.7 67.4,15.7 67.8,15.3 R3.2
  Bottom 0.2: v67.4,45.1 64.1,45.1 58.5,39.5 v58.5,15.7
N$1  (via drill 0.3 pad 1.2)
  Top 1.016: v83.2,16 RFCON1.P$3
  Bottom 1.016: U7.10 v83.2,16
N$2
  Top 0.61: Q1.1 64.98,47.06 R2.1 R1.1
N$3
  Top 0.61: 57.05,46.8 D1.A 61.5,44.85 D4.C | 57.05,46.8 K1.COIL2 | Q1.3 58.25,48 57.05,46.8
N$4
  Top 0.61: Q2.1 65.78,12.66 R5.1 R3.1
N$5
  Top 0.61: 57.05,12.8 D2.A 61.5,10.85 D5.C | 57.05,12.8 K2.COIL2 | Q2.3 57.85,13.6 57.05,12.8
N$6
  Top 0.406: U1.6 68.22,27.68 69.22,26.68 C6.2
  Top 0.813: C6.2 72.17,26.68 L2.1
N$7
  Top 1.27: ACDC1.+VO F1.2
N$8
  Top 0.406: U1.7 C6.1
N$9
  Top 0.406: U1.2 60.86,28.32 C7.1
N$10
  Top 0.406: U1.1 64.78,28.98 65.82,30.02 R6.2
  Top 0.813: R7.1 R6.2
N$11
  Top 0.61: D4.A 61.8,39.22 R11.1
N$12
  Top 0.61: R12.1 61.8,5.22 D5.A
N$16
  Top 0.305: U6.6 76.95,42.75 77.7,43.5 X1.2
N$17
  Top 0.305: U6.7 74.25,43.25 74.8,43.8 74.8,46.2 75.3,46.7 X1.4
N$19
  Top 0.305: L1.2 69.08,37.98 69.75,38.65 U6.26
N$20
  Top 0.305: U6.29 71.25,37.65 71.6,37.3 73.9,37.3 74.3,36.9 C18.2
RFM_IRQ  (via drill 0.3)
  Top 0.2: U6.31 72.25,38.75 73.1,37.9 v74.6,37.9 | v65.2,33.7 v62,33.7
  Bottom 0.2: v74.6,37.9 74.6,36.9 71.4,33.7 v65.2,33.7 | v62,33.7 62.52,33.18 62.52,30.59 75.12,17.99 75.12,13.04 68.08,6 U7.2
RFM_RST  (via drill 0.3)
  Top 0.2: v64.1,4.2 64.18,4.28 R13.2 | U6.19 67.85,42.75 v66.5,44.1
  Bottom 0.2: U7.1 63.9,4 v64.1,4.2 66.74,4.2 75.45,12.91 75.45,18.13 62.85,30.73 62.85,39.47 65.37,42 65.37,42.97 v66.5,44.1
SWCLK
  Top 0.2: U6.1 76.05,40.25 79.07,37.23 TC1.4
SWDIO
  Top 0.2: U6.2 77.75,40.75 78.73,39.77 TC1.2
SWO  (via drill 0.3)
  Top 0.2: U6.3 78.35,41.25 v78.6,41
  Bottom 0.2: v78.6,41 81.14,38.47 TC1.6
  other vias: 81.14,35.96
US0_CLK  (via drill 0.3)
  Top 0.2: U6.21 67.75,41.75 67.3,42.2 v66.5,42.2 | v76.1,11.3 76.14,11.34 U8.6
  Bottom 0.2: v66.5,42.2 63.5,39.2 63.5,31 76.1,18.4 v76.1,11.3 76.8,12 U7.12
US0_MISO  (via drill 0.3)
  Top 0.2: U6.24 67.95,40.25 67.1,39.4 v66.4,39.4 | v83,11.3 77.6,16.7 v77.6,18.3 | v78.1,9.5 76.1,9.5 74.86,8.27 U8.2
  Bottom 0.2: v66.4,39.4 64.62,39.4 64.15,38.93 64.15,31.27 77.12,18.3 v77.6,18.3 | v83,11.3 83,10.6 82.4,10 U7.13 78.6,10 v78.1,9.5
US0_MOSI  (via drill 0.3)
  Top 0.2: U6.23 67.75,40.75 67.4,40.4 v66.4,40.4 | v77.4,15.2 U8.5 v77.41,11.3 v77.4,11.3
  Bottom 0.2: v66.4,40.4 65.16,40.4 63.83,39.06 63.83,31.14 77.4,17.56 v77.4,15.2 | v77.4,11.3 77.4,9 78.4,8 U7.14

### Text on the board
tPlace: L OUT1 / / L IN / / L OUT2 | N